# EAGLE schematic MainBoard (EAGLE 8.6.0)

## Sheet 1 of 4
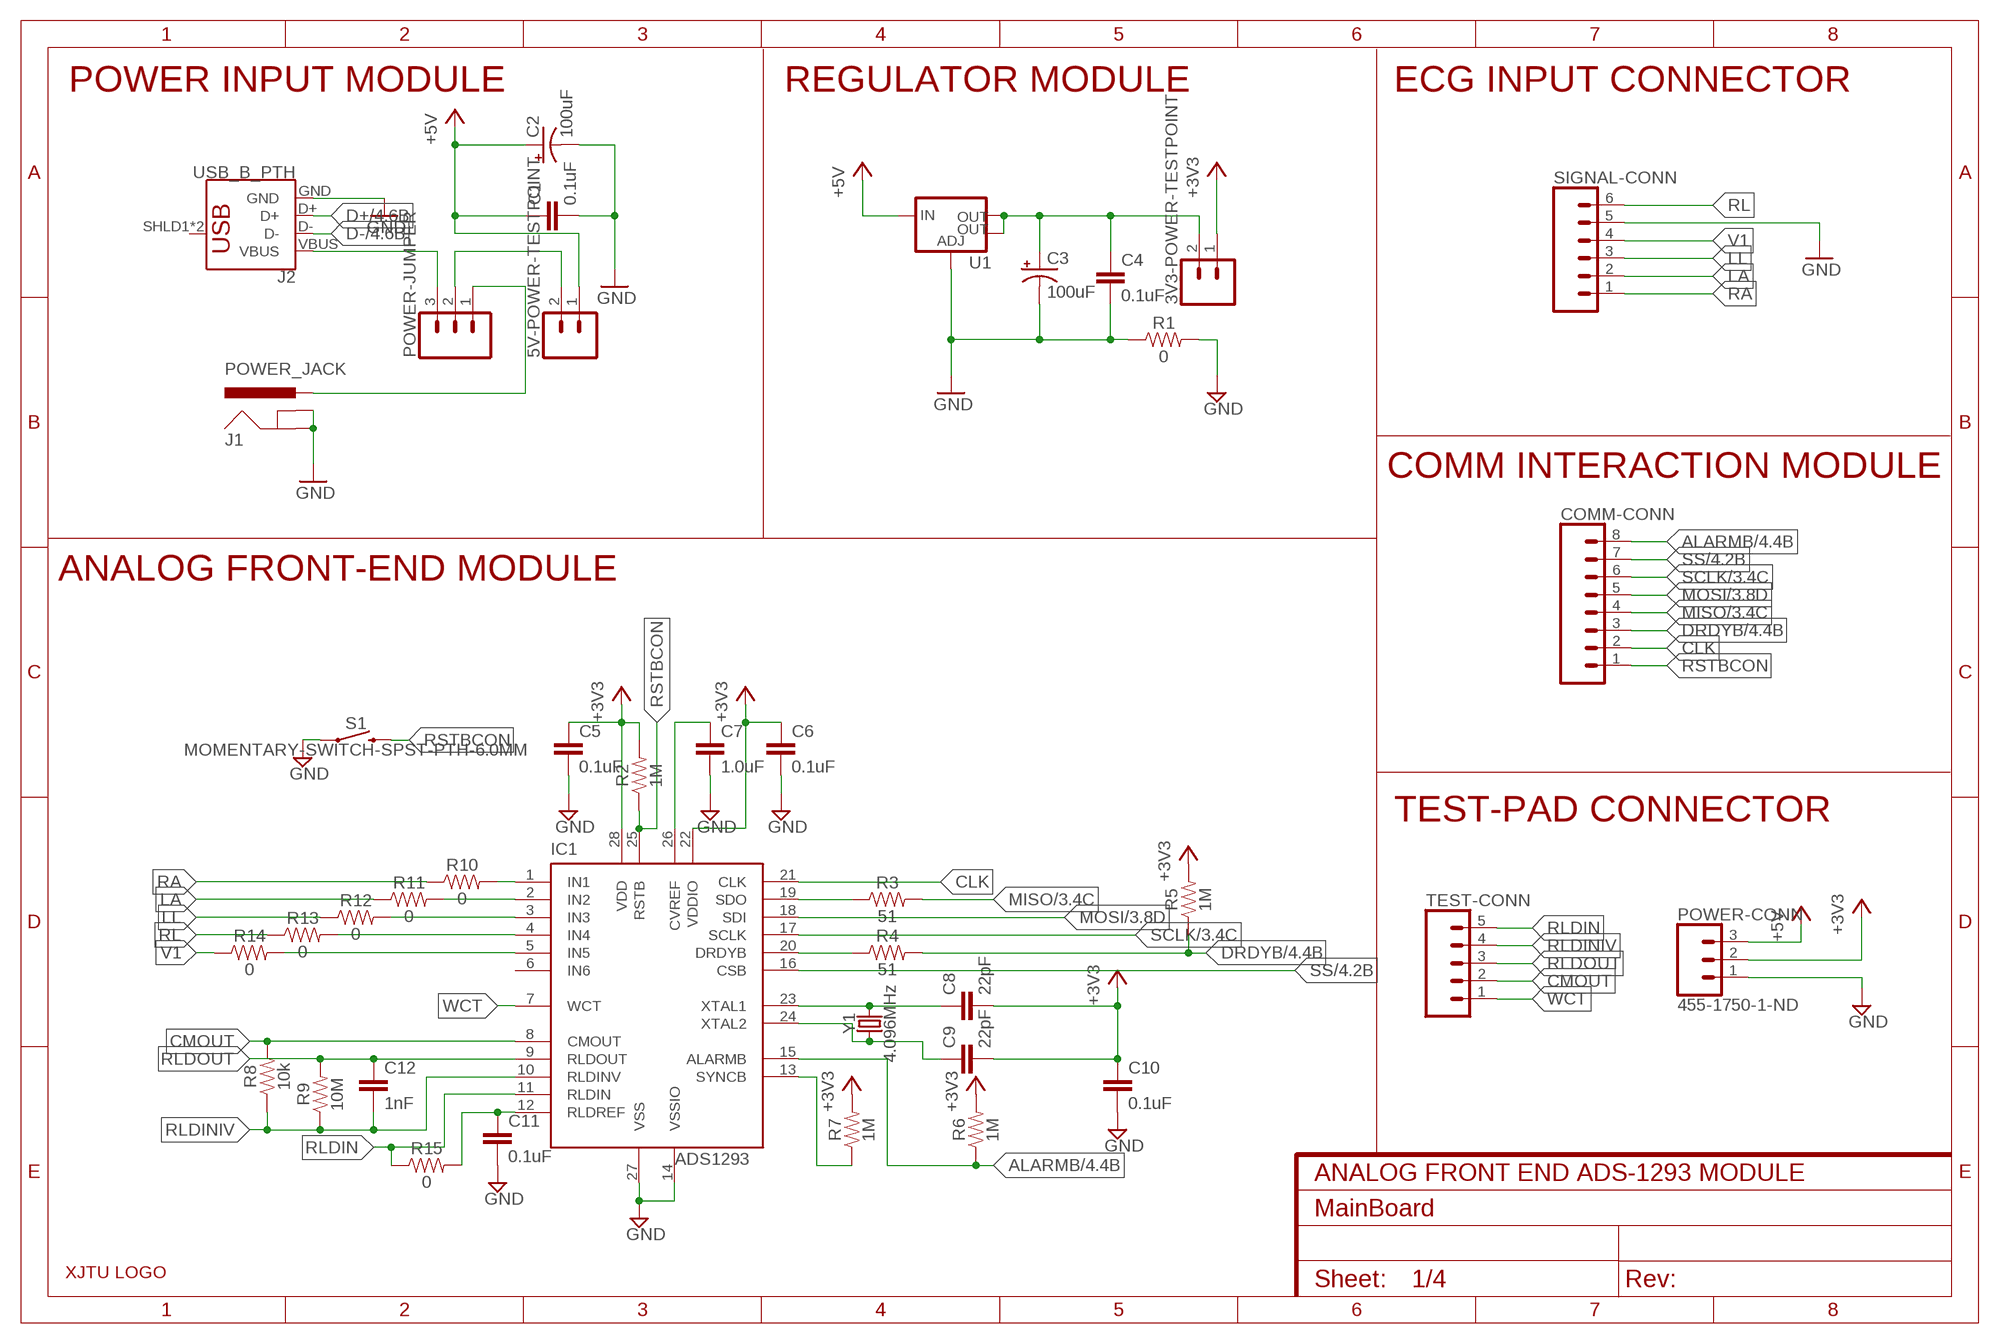
[diagram p0: schematic, sheet 1]
ADS1293TESTBOARD (FRAME-A4L): CNAME: ANALOG FRONT END ADS-1293 MODULE; CREVISION: JINMING LI; DESIGNER: JINGJIE LI

### Parts
3V3-POWER-TESTPOINT  CONN_02  [1X02]
5V-POWER-TESTPOINT  CONN_02  [1X02]
C1  0.1uF  0.1UF-0603-25V-(+80/-20%)  [0603]
C2  100uF  100UF-POLAR-RADIAL-2.5MM-25V-20%  [CPOL-RADIAL-2.5MM-6.5MM]
C3  100uF  100UF-POLAR-RADIAL-2.5MM-25V-20%  [CPOL-RADIAL-2.5MM-6.5MM]
C4  0.1uF  0.1UF-0603-25V-(+80/-20%)  [0603]
C5  0.1uF  0.1UF-0603-25V-(+80/-20%)  [0603]
C6  0.1uF  0.1UF-0603-25V-(+80/-20%)  [0603]
C7  1.0uF  1.0UF-0805-25V-10%  [0805]
C8  22pF  22PF-0603-50V-5%  [0603]
C9  22pF  22PF-0603-50V-5%  [0603]
C10  0.1uF  0.1UF-0603-25V-(+80/-20%)  [0603]
C11  0.1uF  0.1UF-0603-25V-(+80/-20%)  [0603]
C12  1nF  1.0NF/1000PF-0603-50V-10%  [0603]
COMM-CONN  CONN_08"  [1X08]
IC1  ADS1293  [QFN28-5X5]
J1  POWER_JACK  [POWER_JACK_PTH]
J2  USB_B_PTH  [USB-B-PTH]
POWER-CONN  455-1750-1-ND  CONN_03  [1X03]
POWER-JUMPER  CONN_03  [1X03]
R1  0  0OHM-0603-1/10W-5%  [0603]
R2  1M  1MOHM-0603-1/4W-5%  [0603]
R3  51  22OHM-0603-1/10W-1%  [0603]
R4  51  22OHM-0603-1/10W-1%  [0603]
R5  1M  1MOHM-0603-1/4W-5%  [0603]
R6  1M  1MOHM-0603-1/4W-5%  [0603]
R7  1M  1MOHM-0603-1/4W-5%  [0603]
R8  10k  10KOHM-0603-1/10W-1%  [0603]
R9  10M  10MOHM-0603-1/10W-5%  [0603]
R10  0  0OHM-0603-1/10W-5%  [0603]
R11  0  0OHM-0603-1/10W-5%  [0603]
R12  0  0OHM-0603-1/10W-5%  [0603]
R13  0  0OHM-0603-1/10W-5%  [0603]
R14  0  0OHM-0603-1/10W-5%  [0603]
R15  0  0OHM-0603-1/10W-5%  [0603]
S1  MOMENTARY-SWITCH-SPST-PTH-6.0MM  [TACTILE_SWITCH_PTH_6.0MM]
SIGNAL-CONN  CONN_06POLAR  [MOLEX-1X6]
TEST-CONN  CONN_05  [1X05]
U1  V_REG_LM1117SOT223  [SOT223]
U$6  XJTULOGO  [XJTULOGO]
Y1  4.096MHz  CRYSTALPTH-HC49US  [HC49US]

### Nets
+3V3: 3V3-POWER-TESTPOINT.1 C5.1 C6.1 C8.2 C9.2 C10.1 IC1.22(VDDIO) IC1.28(VDD) POWER-CONN.2 R2.2 R5.2 R6.2 R7.2 ; also sheet 4
+5V: 5V-POWER-TESTPOINT.1 C1.1 C2.1(+) POWER-CONN.3 U1.3(IN) ; also sheet 2,4
ALARMB: COMM-CONN.8 IC1.15(ALARMB) R6.1 ; also sheet 4
CLK: COMM-CONN.2 IC1.21(CLK)
CMOUT: IC1.8(CMOUT) R8.2 TEST-CONN.2
D+: J2.D+ ; also sheet 4
D-: J2.D- ; also sheet 4
DRDYB: COMM-CONN.3 R4.2 R5.1 ; also sheet 4
GND: C1.2 C2.2(-) C3.2(-) C4.2 C5.2 C6.2 C7.2 C10.2 C11.2 IC1.14(VSSIO) IC1.27(VSS) J1.GND J1.GNDBREAK J2.GND POWER-CONN.1 R1.1 R1.2 S1.1 SIGNAL-CONN.5 U1.1(ADJ) ; also sheet 2,3,4
LA: R11.1 SIGNAL-CONN.2
LL: R12.1 SIGNAL-CONN.3
MISO: COMM-CONN.4 R3.2 ; also sheet 3,4
MOSI: COMM-CONN.5 IC1.18(SDI) ; also sheet 3,4
N$1: C7.1 IC1.26(CVREF)
N$2: J2.VBUS POWER-JUMPER.3
N$3: J1.PWR POWER-JUMPER.1
N$5: C8.1 IC1.23(XTAL1) Y1.2
N$6: C9.1 IC1.24(XTAL2) Y1.1
N$7: IC1.19(SDO) R3.1
N$8: IC1.20(DRDYB) R4.1
N$9: IC1.13(SYNCB) R7.1
N$10: C11.1 IC1.12(RLDREF) R15.2
N$11: IC1.1(IN1) R10.2
N$12: IC1.2(IN2) R11.2
N$13: IC1.3(IN3) R12.2
N$14: IC1.4(IN4) R13.2
N$15: IC1.5(IN5) R14.2
N$16: 5V-POWER-TESTPOINT.2 POWER-JUMPER.2
N$17: 3V3-POWER-TESTPOINT.2 C3.1(+) C4.1 U1.2(OUT) U1.4(OUT)
RA: R10.1 SIGNAL-CONN.1
RL: R13.1 SIGNAL-CONN.6
RLDIN: IC1.11(RLDIN) R15.1 TEST-CONN.5
RLDINIV: C12.2 IC1.10(RLDINV) R8.1 R9.1 TEST-CONN.4
RLDOUT: C12.1 IC1.9(RLDOUT) R9.2 TEST-CONN.3
RSTBCON: COMM-CONN.1 IC1.25(RSTB) R2.1 S1.3
SCLK: COMM-CONN.6 IC1.17(SCLK) ; also sheet 3,4
SS: COMM-CONN.7 IC1.16(CSB) ; also sheet 4
V1: R14.1 SIGNAL-CONN.4
WCT: IC1.7(WCT) TEST-CONN.1
Unconnected: IC1.6(IN6) J2.SHLD1(SHIELD) J2.SHLD2(SHIELD)

### Notes on the sheet
- POWER INPUT MODULE | REGULATOR MODULE | ECG INPUT CONNECTOR
- COMM INTERACTION MODULE
- ANALOG FRONT-END MODULE
- TEST-PAD CONNECTOR

## Sheet 2 of 4
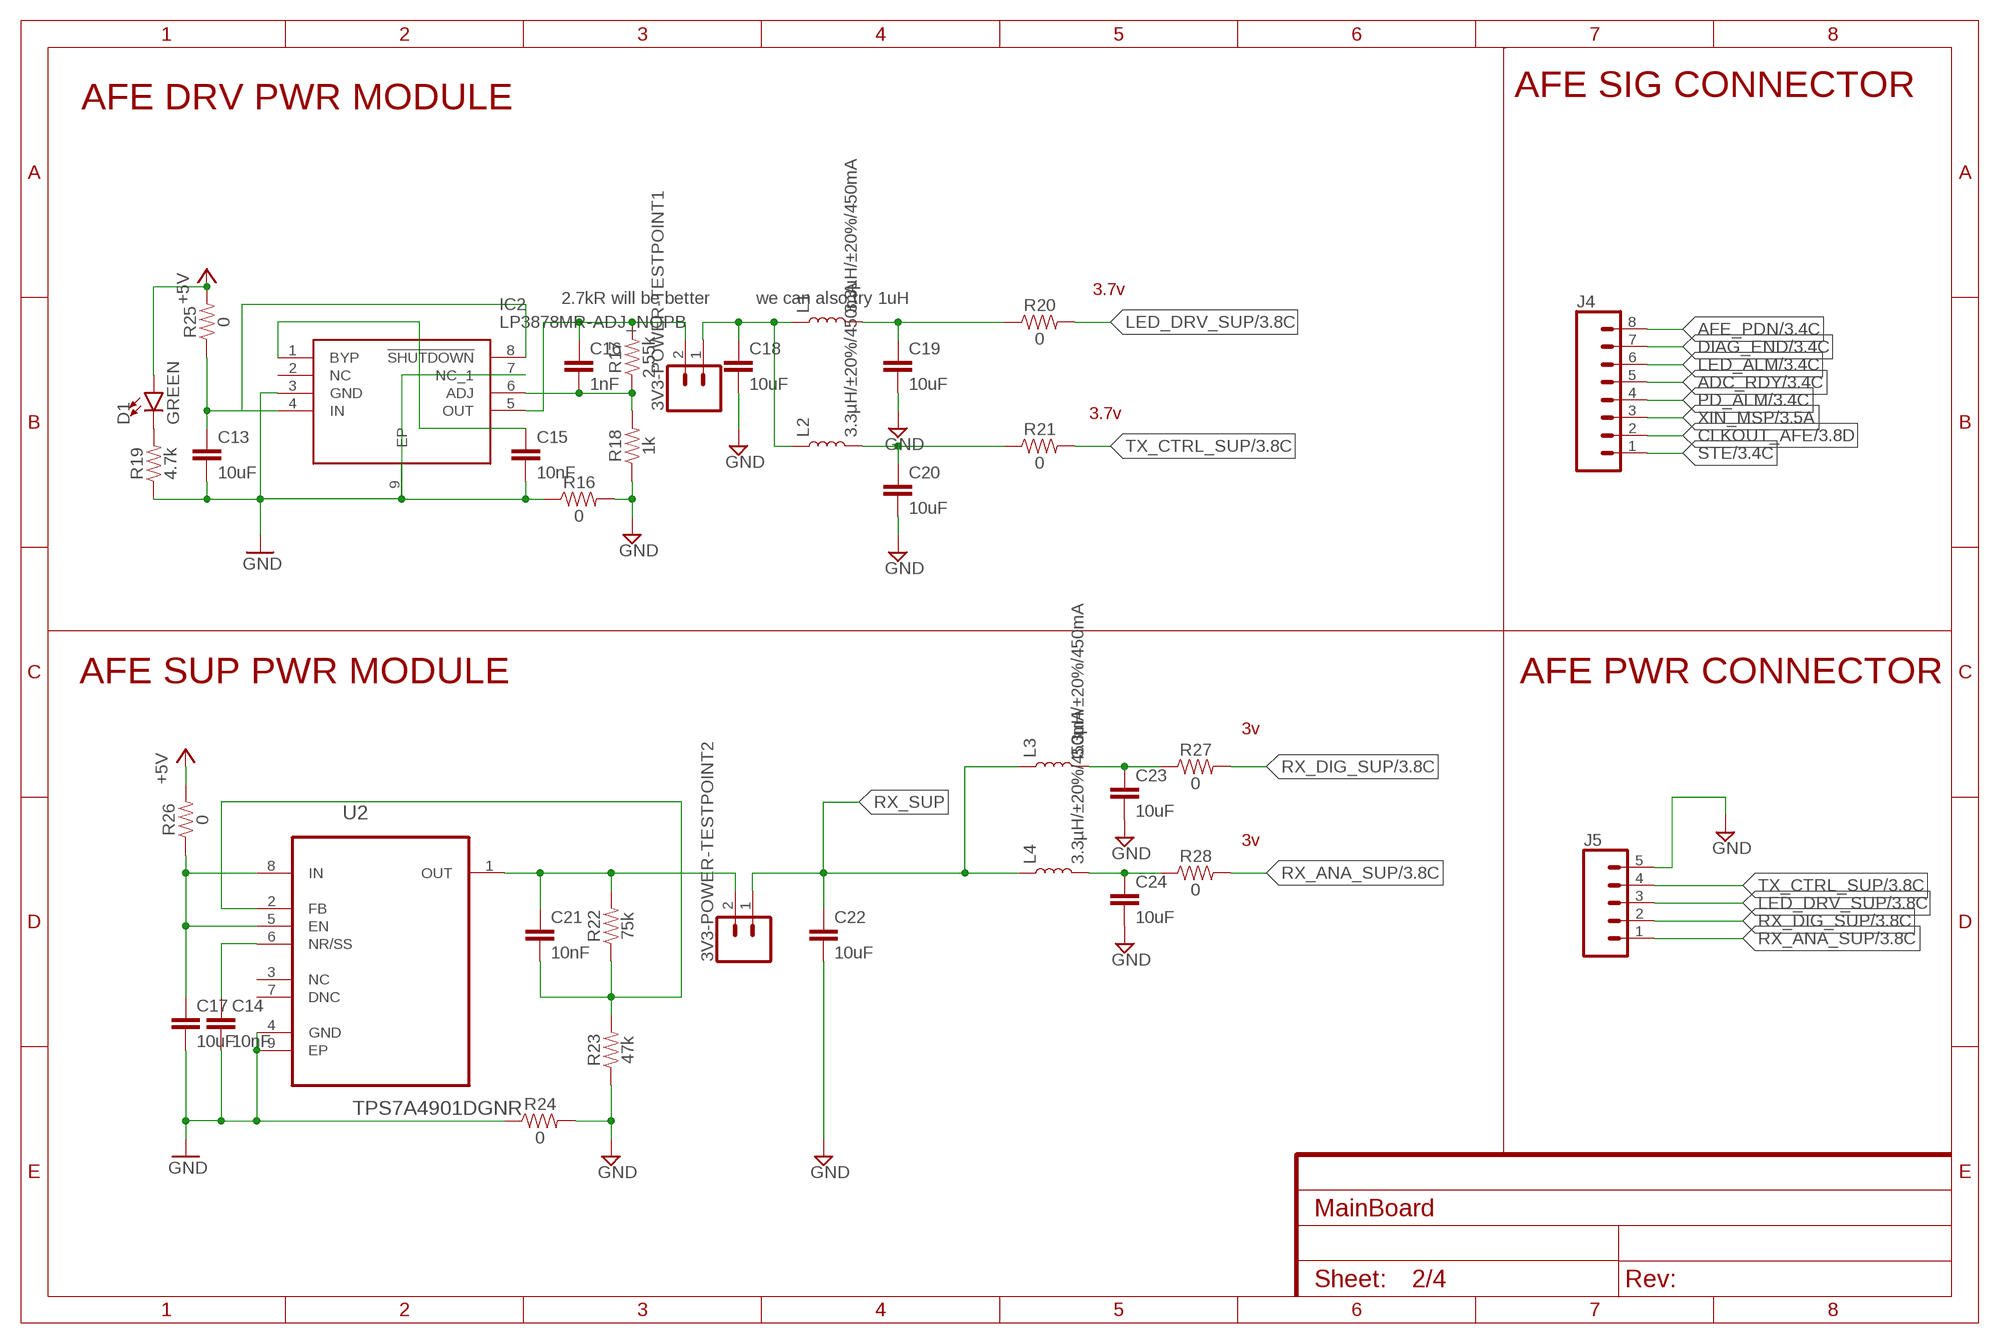
[diagram p1: schematic, sheet 2]
FRAME2 (FRAME-A4L): CNAME: AFE4400 LDO Module; CREVISION: JINMING LI; DESIGNER: JINGJIE LI

### Parts
3V3-POWER-TESTPOINT1  CONN_02  [1X02]
3V3-POWER-TESTPOINT2  CONN_02  [1X02]
C13  10uF  10UF-1206-6.3V-20%  [1206]
C14  10nF  10NF-0603-50V-10%  [0603]
C15  10nF  10NF-0603-50V-10%  [0603]
C16  1nF  1.0NF/1000PF-0603-50V-10%  [0603]
C17  10uF  10UF-1206-6.3V-20%  [1206]
C18  10uF  10UF-1206-6.3V-20%  [1206]
C19  10uF  10UF-1206-6.3V-20%  [1206]
C20  10uF  10UF-1206-6.3V-20%  [1206]
C21  10nF  10NF-0603-50V-10%  [0603]
C22  10uF  10UF-1206-6.3V-20%  [1206]
C23  10uF  10UF-1206-6.3V-20%  [1206]
C24  10uF  10UF-1206-6.3V-20%  [1206]
D1  GREEN  LED-GREEN1206  [LED-1206]
IC2  LP3878MR-ADJ_NOPB  [SOIC127P602X168-9N]
J4  CONN_08"  [1X08]
J5  CONN_05  [1X05]
L1  3.3µH/±20%/450mA  INDUCTOR-0805-3.3UH  [0805]
L2  3.3µH/±20%/450mA  INDUCTOR-0805-3.3UH  [0805]
L3  3.3µH/±20%/450mA  INDUCTOR-0805-3.3UH  [0805]
L4  3.3µH/±20%/450mA  INDUCTOR-0805-3.3UH  [0805]
R16  0  0OHM-0603-1/10W-5%  [0603]
R17  2.55k  2.55KOHM-0603-1/10W-1%  [0603]
R18  1k  1KOHM-0603-1/10W-1%  [0603]
R19  4.7k  4.7KOHM-0603-1/10W-1%  [0603]
R20  0  0OHM-0603-1/10W-5%  [0603]
R21  0  0OHM-0603-1/10W-5%  [0603]
R22  75k  75KOHM-0603-1/10W-1%  [0603]
R23  47k  47KOHM-0603-1/10W-1%  [0603]
R24  0  0OHM-0603-1/10W-5%  [0603]
R25  0  0OHM-0603-1/10W-5%  [0603]
R26  0  0OHM-0603-1/10W-5%  [0603]
R27  0  0OHM-0603-1/10W-5%  [0603]
R28  0  0OHM-0603-1/10W-5%  [0603]
U2  TPS7A4901DGNR  [SOP65P490X110-9N]

### Nets
+5V: D1.A R25.2 R26.2 ; also sheet 1,4
ADC_RDY: J4.5 ; also sheet 3,4
AFE_PDN: J4.8 ; also sheet 3,4
CLKOUT_AFE: J4.2 ; also sheet 3
DIAG_END: J4.7 ; also sheet 3,4
GND: C13.2 C14.2 C15.2 C17.2 C18.2 C19.2 C20.2 C22.2 C23.2 C24.2 IC2.3(GND) IC2.7(NC_1) IC2.9(EP) J5.5 R16.1 R16.2 R18.1 R19.1 R23.1 R24.1 R24.2 U2.4(GND) U2.9(EP) ; also sheet 1,3,4
LED_ALM: J4.6 ; also sheet 3,4
LED_DRV_SUP: J5.3 R20.2 ; also sheet 3
N$4: D1.C R19.2
N$18: 3V3-POWER-TESTPOINT1.1 C18.1 L1.1 L2.1
N$19: C16.2 IC2.6(ADJ) R17.1 R18.2
N$20: C15.1 IC2.1(BYP)
N$21: 3V3-POWER-TESTPOINT1.2 C16.1 IC2.5(OUT) R17.2
N$22: C14.1 U2.6(NR/SS)
N$23: C19.1 L1.2 R20.1
N$24: C20.1 L2.2 R21.1
N$25: C17.1 R26.1 U2.5(EN) U2.8(IN)
N$26: 3V3-POWER-TESTPOINT2.2 C21.1 R22.2 U2.1(OUT)
N$27: C21.2 R22.1 R23.2 U2.2(FB)
N$28: C23.1 L3.2 R27.1
N$29: C13.1 IC2.4(IN) IC2.8(!SHUTDOWN) R25.1
N$30: C24.1 L4.2 R28.1
PD_ALM: J4.4 ; also sheet 3,4
RX_ANA_SUP: J5.1 R28.2 ; also sheet 3
RX_DIG_SUP: J5.2 R27.2 ; also sheet 3
RX_SUP: 3V3-POWER-TESTPOINT2.1 C22.1 L3.1 L4.1
STE: J4.1 ; also sheet 3,4
TX_CTRL_SUP: J5.4 R21.2 ; also sheet 3
XIN_MSP: J4.3 ; also sheet 3,4
Unconnected: IC2.2(NC) U2.3(NC) U2.7(DNC)

### Notes on the sheet
- AFE SIG CONNECTOR
- AFE DRV PWR MODULE
- 3.7v
- 2.7kR will be better | we can also try 1uH
- 3.7v
- AFE SUP PWR MODULE | AFE PWR CONNECTOR
- 3v
- 3v

## Sheet 3 of 4
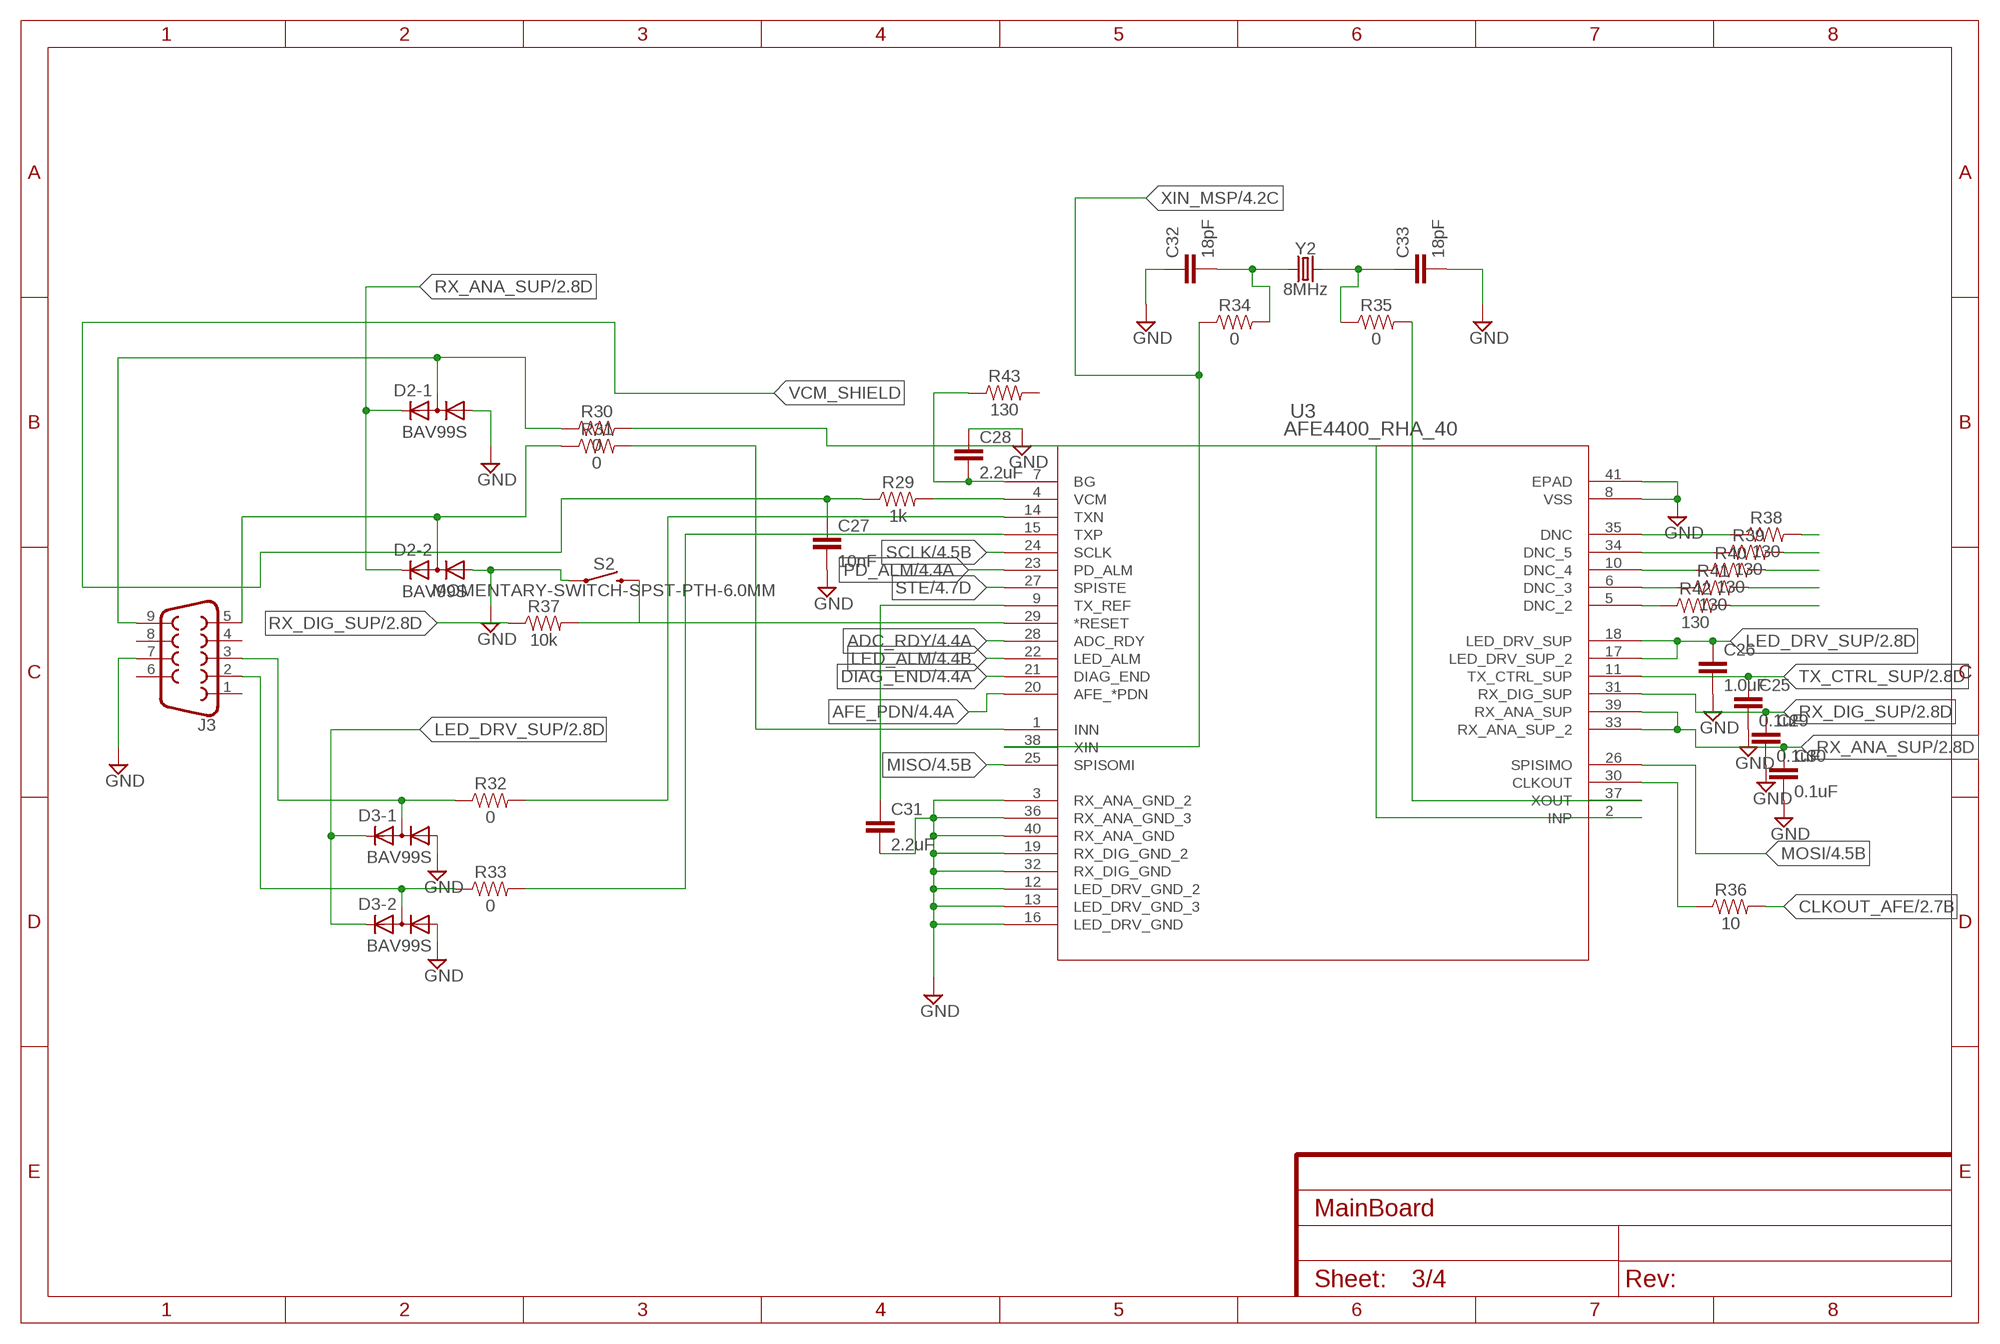
[diagram p2: schematic, sheet 3]
FRAME1 (FRAME-A4L): CNAME: AFE4400 Oximeter Module; CREVISION: JINMING LI; DESIGNER: JINGJIE LI

### Parts
C25  0.1uF  0.1UF-0603-25V-5%  [0603]
C26  1.0uF  1.0UF-0805-25V-10%  [0805]
C27  10nF  10NF-0603-50V-10%  [0603]
C28  2.2uF  2.2UF-0805-25V-(+80/-20%)  [0805]
C29  0.1uF  0.1UF-0603-25V-5%  [0603]
C30  0.1uF  0.1UF-0603-25V-5%  [0603]
C31  2.2uF  2.2UF-0805-25V-(+80/-20%)  [0805]
C32  18pF  18PF-0603-50V-5%  [0603]
C33  18pF  18PF-0603-50V-5%  [0603]
D2  BAV99S  [SOT363]
D3  BAV99S  [SOT363]
J3  DB9FEMALE  [DB9]
R29  1k  1KOHM-0603-1/10W-1%  [0603]
R30  0  0OHM-0603-1/10W-5%  [0603]
R31  0  0OHM-0603-1/10W-5%  [0603]
R32  0  0OHM-0603-1/10W-5%  [0603]
R33  0  0OHM-0603-1/10W-5%  [0603]
R34  0  0OHM-0603-1/10W-5%  [0603]
R35  0  0OHM-0603-1/10W-5%  [0603]
R36  10  10OHM-0603-1/10W-1%  [0603]
R37  10k  10KOHM-0603-1/10W-1%  [0603]
R38  130  330OHM-0603-1/10W-1%  [0603]
R39  130  330OHM-0603-1/10W-1%  [0603]
R40  130  330OHM-0603-1/10W-1%  [0603]
R41  130  330OHM-0603-1/10W-1%  [0603]
R42  130  330OHM-0603-1/10W-1%  [0603]
R43  130  330OHM-0603-1/10W-1%  [0603]
S2  MOMENTARY-SWITCH-SPST-PTH-6.0MM  [TACTILE_SWITCH_PTH_6.0MM]
U3  AFE4400_RHA_40  [RHA40_4P15X4P15]
Y2  8MHz  CRYSTAL-8MHZSMD-5X3.2  [CRYSTAL-SMD-5X3.2-4PAD]

### Nets
ADC_RDY: U3.28(ADC_RDY) ; also sheet 2,4
AFE_PDN: U3.20(AFE_*PDN) ; also sheet 2,4
CLKOUT_AFE: R36.2 ; also sheet 2
DIAG_END: U3.21(DIAG_END) ; also sheet 2,4
GND: C25.2 C26.2 C27.2 C28.1 C29.2 C30.2 C31.2 C32.1 C33.2 D2.1(-1:A1) D2.4(-2:A1) D3.1(-1:A1) D3.4(-2:A1) J3.7 S2.1 U3.3(RX_ANA_GND_2) U3.8(VSS) U3.12(LED_DRV_GND_2) U3.13(LED_DRV_GND_3) U3.16(LED_DRV_GND) U3.19(RX_DIG_GND_2) U3.32(RX_DIG_GND) U3.36(RX_ANA_GND_3) U3.40(RX_ANA_GND) U3.41(EPAD) ; also sheet 1,2,4
LED_ALM: U3.22(LED_ALM) ; also sheet 2,4
LED_DRV_SUP: C26.1 D3.2(-1:K2) D3.5(-2:K2) U3.17(LED_DRV_SUP_2) U3.18(LED_DRV_SUP) ; also sheet 2
MISO: U3.25(SPISOMI) ; also sheet 1,4
MOSI: U3.26(SPISIMO) ; also sheet 1,4
N$31: C28.2 R43.1 U3.7(BG)
N$32: C31.1 U3.9(TX_REF)
N$33: R32.2 U3.14(TXN)
N$34: R29.2 U3.4(VCM)
N$36: R31.2 U3.1(INN)
N$37: R30.2 U3.2(INP)
N$38: D2.3(-2:K1A2) J3.5 R31.1
N$39: D2.6(-1:K1A2) J3.9 R30.1
N$40: R33.2 U3.15(TXP)
N$41: D3.6(-1:K1A2) J3.3 R32.1
N$42: D3.3(-2:K1A2) J3.2 R33.1
N$43: C32.2 R34.2 Y2.1
N$44: C33.1 R35.1 Y2.3
N$45: R36.1 U3.30(CLKOUT)
N$46: R37.2 S2.3 U3.29(*RESET)
N$48: R35.2 U3.37(XOUT)
N$49: R38.1 U3.35(DNC)
N$50: R42.1 U3.5(DNC_2)
N$52: R41.1 U3.6(DNC_3)
N$53: R40.1 U3.10(DNC_4)
N$54: R39.1 U3.34(DNC_5)
N$55: R38.2
N$56: R39.2
N$57: R40.2
N$58: R41.2
N$59: R42.2
PD_ALM: U3.23(PD_ALM) ; also sheet 2,4
RX_ANA_SUP: C30.1 D2.2(-1:K2) D2.5(-2:K2) U3.33(RX_ANA_SUP_2) U3.39(RX_ANA_SUP) ; also sheet 2
RX_DIG_SUP: C29.1 R37.1 U3.31(RX_DIG_SUP) ; also sheet 2
SCLK: U3.24(SCLK) ; also sheet 1,4
STE: U3.27(SPISTE) ; also sheet 2,4
TX_CTRL_SUP: C25.1 U3.11(TX_CTRL_SUP) ; also sheet 2
VCM_SHIELD: C27.1 R29.1
XIN_MSP: R34.1 U3.38(XIN) ; also sheet 2,4
Unconnected: J3.1 J3.4 J3.6 J3.8 R43.2

## Sheet 4 of 4
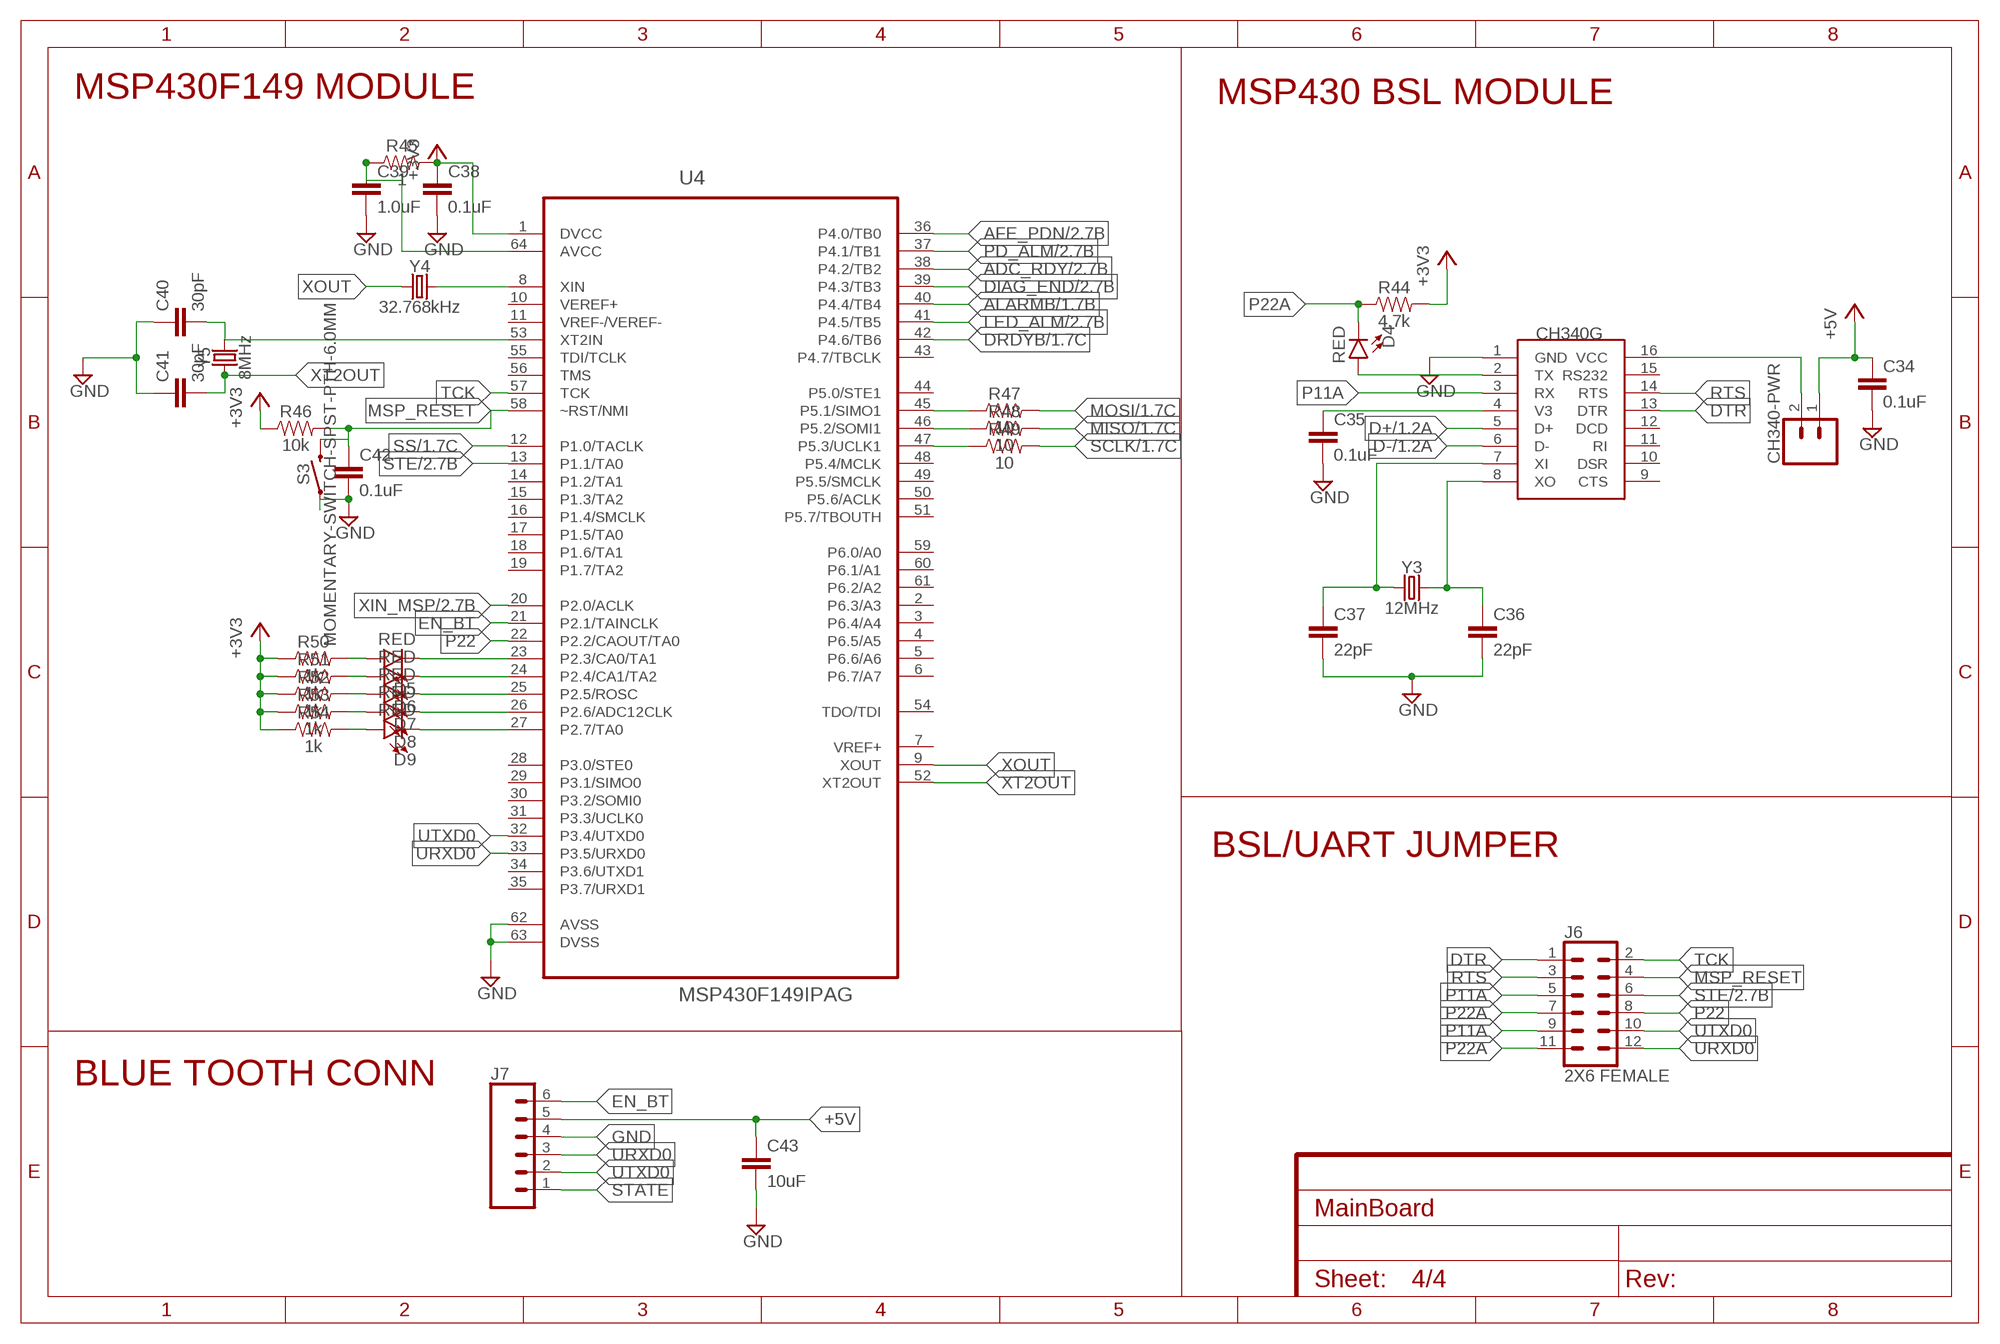
[diagram p3: schematic, sheet 4]
FRAME3 (FRAME-A4L): CNAME: MSP430 MCU Module; CREVISION: JINMING LI; DESIGNER: JINGJIE LI

### Parts
C34  0.1uF  0.1UF-0603-25V-(+80/-20%)  [0603]
C35  0.1uF  0.1UF-0603-25V-(+80/-20%)  [0603]
C36  22pF  22PF-0603-50V-5%  [0603]
C37  22pF  22PF-0603-50V-5%  [0603]
C38  0.1uF  0.1UF-0603-25V-5%  [0603]
C39  1.0uF  1.0UF-0603-16V-10%  [0603]
C40  30pF  33PF-0603-50V-5%  [0603]
C41  30pF  33PF-0603-50V-5%  [0603]
C42  0.1uF  0.1UF-0603-25V-5%  [0603]
C43  10uF  10UF-1206-6.3V-20%  [1206]
CH340-PWR  CONN_02  [1X02]
D4  RED  LED-RED0603  [LED-0603]
D5  RED  LED-RED0603  [LED-0603]
D6  RED  LED-RED0603  [LED-0603]
D7  RED  LED-RED0603  [LED-0603]
D8  RED  LED-RED0603  [LED-0603]
D9  RED  LED-RED0603  [LED-0603]
J6  2X6 FEMALE  CONN_06X2PTH_FEMALE  [2X6]
J7  CONN_06SILK_FEMALE_PTH  [1X06]
R44  4.7k  4.7KOHM-0603-1/10W-1%  [0603]
R45  1  1OHM-0603-1/10W-1%  [0603]
R46  10k  10KOHM-0603-1/10W-1%  [0603]
R47  10  10OHM-0603-1/10W-1%  [0603]
R48  10  10OHM-0603-1/10W-1%  [0603]
R49  10  10OHM-0603-1/10W-1%  [0603]
R50  1k  1KOHM-0603-1/10W-1%  [0603]
R51  1k  1KOHM-0603-1/10W-1%  [0603]
R52  1k  1KOHM-0603-1/10W-1%  [0603]
R53  1k  1KOHM-0603-1/10W-1%  [0603]
R54  1k  1KOHM-0603-1/10W-1%  [0603]
S3  MOMENTARY-SWITCH-SPST-PTH-6.0MM  [TACTILE_SWITCH_PTH_6.0MM]
U4  MSP430F149IPAG  [QFP50P1200X1200X120-64N]
U$5  CH340G  [SOIC16]
Y3  12MHz  CRYSTAL-12MHZ"  [CRYSTAL-SMD-5X3.2-4PAD]
Y4  32.768kHz  CRYSTAL-32.768KHZSMD-3.2X1.5  [CRYSTAL-SMD-3.2X1.5MM]
Y5  8MHz  CRYSTAL-8MHZSMD-5X3.2  [CRYSTAL-SMD-5X3.2-4PAD]

### Nets
+3V3: C38.1 R44.2 R45.2 R46.1 R50.1 R51.1 R52.1 R53.1 R54.1 U4.1(DVCC) ; also sheet 1
+5V: C34.1 C43.1 CH340-PWR.1 J7.5 ; also sheet 1,2
ADC_RDY: U4.38(P4.2/TB2) ; also sheet 2,3
AFE_PDN: U4.36(P4.0/TB0) ; also sheet 2,3
ALARMB: U4.40(P4.4/TB4) ; also sheet 1
D+: U$5.5(D+) ; also sheet 1
D-: U$5.6(D-) ; also sheet 1
DIAG_END: U4.39(P4.3/TB3) ; also sheet 2,3
DRDYB: U4.42(P4.6/TB6) ; also sheet 1
DTR: J6.1 U$5.13(DTR)
EN_BT: J7.6 U4.21(P2.1/TAINCLK)
GND: C34.2 C35.2 C36.2 C37.2 C38.2 C39.2 C40.1 C41.1 C42.2 C43.2 J7.4 S3.1 U4.62(AVSS) U4.63(DVSS) U$5.1(GND) ; also sheet 1,2,3
LED_ALM: U4.41(P4.5/TB5) ; also sheet 2,3
MISO: R48.2 ; also sheet 1,3
MOSI: R47.2 ; also sheet 1,3
MSP_RESET: C42.1 J6.4 R46.2 S3.3 U4.58(~RST/NMI)
N$65: C39.1 R45.1 U4.64(AVCC)
N$66: R47.1 U4.45(P5.1/SIMO1)
N$67: C35.1 U$5.4(V3)
N$68: D4.A U$5.2(TX)
N$69: U4.8(XIN) Y4.P$2
N$70: C40.2 U4.53(XT2IN) Y5.3
N$71: R48.1 U4.46(P5.2/SOMI1)
N$72: R49.1 U4.47(P5.3/UCLK1)
N$73: D5.C U4.23(P2.3/CA0/TA1)
N$74: D6.C U4.24(P2.4/CA1/TA2)
N$75: D7.C U4.25(P2.5/ROSC)
N$76: D8.C U4.26(P2.6/ADC12CLK)
N$77: D9.C U4.27(P2.7/TA0)
N$78: D5.A R50.2
N$79: D6.A R51.2
N$80: D7.A R52.2
N$81: D8.A R53.2
N$82: D9.A R54.2
N$84: CH340-PWR.2 U$5.16(VCC)
P11A: J6.5 J6.9 U$5.3(RX)
P22: J6.8 U4.22(P2.2/CAOUT/TA0)
P22A: D4.C J6.7 J6.11 R44.1
PD_ALM: U4.37(P4.1/TB1) ; also sheet 2,3
RTS: J6.3 U$5.14(RTS)
SCLK: R49.2 ; also sheet 1,3
SS: U4.12(P1.0/TACLK) ; also sheet 1
STATE: J7.1
STE: J6.6 U4.13(P1.1/TA0) ; also sheet 2,3
TCK: J6.2 U4.57(TCK)
URXD0: J6.12 J7.3 U4.33(P3.5/URXD0)
UTXD0: J6.10 J7.2 U4.32(P3.4/UTXD0)
XI: C37.1 U$5.7(XI) Y3.1
XIN_MSP: U4.20(P2.0/ACLK) ; also sheet 2,3
XO: C36.1 U$5.8(XO) Y3.3
XOUT: U4.9(XOUT) Y4.P$1
XT2OUT: C41.2 U4.52(XT2OUT) Y5.1
Unconnected: U4.2(P6.3/A3) U4.3(P6.4/A4) U4.4(P6.5/A5) U4.5(P6.6/A6) U4.6(P6.7/A7) U4.7(VREF+) U4.10(VEREF+) U4.11(VREF-/VEREF-) U4.14(P1.2/TA1) U4.15(P1.3/TA2) U4.16(P1.4/SMCLK) U4.17(P1.5/TA0) U4.18(P1.6/TA1) U4.19(P1.7/TA2) U4.28(P3.0/STE0) U4.29(P3.1/SIMO0) U4.30(P3.2/SOMI0) U4.31(P3.3/UCLK0) U4.34(P3.6/UTXD1) U4.35(P3.7/URXD1) U4.43(P4.7/TBCLK) U4.44(P5.0/STE1) U4.48(P5.4/MCLK) U4.49(P5.5/SMCLK) U4.50(P5.6/ACLK) U4.51(P5.7/TBOUTH) U4.54(TDO/TDI) U4.55(TDI/TCLK) U4.56(TMS) U4.59(P6.0/A0) U4.60(P6.1/A1) U4.61(P6.2/A2) U$5.9(CTS) U$5.10(DSR) U$5.11(RI) U$5.12(DCD) U$5.15(RS232)

### Notes on the sheet
- MSP430F149 MODULE | MSP430 BSL MODULE
- BSL/UART JUMPER
- BLUE TOOTH CONN

## Library data of the parts
3V3-POWER-TESTPOINT 3V3-POWER-TESTPOINT1 3V3-POWER-TESTPOINT2 5V-POWER-TESTPOINT CH340-PWR = SparkFun-Connectors:CONN_02: Multi connection point. Often used as Generic Header-pin footprint for 0.1 inch spaced/style header connections On any of the 0.1 inch spaced packages, you can populate with these: Break Away Headers - Straight <https://www.sparkfun.com/products/116> (PRT-00116) Break Away Male Headers - Right Angle <https://www.sparkfun.com/products/553> (PRT-00553) Female Headers <https://www.sparkfun.com/products/115> (PRT-00115) Break Away Headers - Machine Pin <https://www.sparkfun.com/products/117> (PRT-00117) Break Away Female Headers - Swiss Machine Pin <https://www.sparkfun.com/products/743> (PRT-00743) For SCREWTERMINALS and SPRING TERMINALS visit here: Screw Terimnals on SparkFun.com <https://www.sparkfun.com/search/results?term=Screw+Terminals> (5mm/3.5mm/2.54mm spacing) This device is also useful as a general connection point to wire up your design to another part of your project. Our various solder wires solder well into these plated through hole pads. Hook-Up Wire - Assortment (Stranded, 22 AWG) <https://www.sparkfun.com/products/11375> (PRT-11375) Hook-Up Wire - Assortment (Solid Core, 22 AWG) <https://www.sparkfun.com/products/11367> (PRT-11367) View the entire wire category on our website here <https://www.sparkfun.com/categories/141> Special notes: Molex polarized connector foot print use with: PRT-08233 with associated crimp pins and housings. 2.54_SCREWTERM for use with PRT-10571. 3.5mm Screw Terminal footprints for PRT-08084 5mm Screw Terminal footprints for use with PRT-08432
C1 C4-C6 C10 C11 C34 C35 = SparkFun-Capacitors:0.1UF: 0.1µF ceramic capacitors A capacitor is a passive two-terminal electrical component used to store electrical energy temporarily in an electric field.; PROD_ID: CAP-00810
C2 C3 = SparkFun-Capacitors:100UF-POLAR: 100µF polarized capacitors A capacitor is a passive two-terminal electrical component used to store electrical energy temporarily in an electric field.; PROD_ID: CAP-08439
C7 C26 = SparkFun-Capacitors:1.0UF: 1µF ceramic capacitors A capacitor is a passive two-terminal electrical component used to store electrical energy temporarily in an electric field.; PROD_ID: CAP-08064
C8 C9 C36 C37 = SparkFun-Capacitors:22PF: 22pF ceramic capacitors A capacitor is a passive two-terminal electrical component used to store electrical energy temporarily in an electric field.; PROD_ID: CAP-07876
C12 C16 = SparkFun-Capacitors:1.0NF/1000PF: 1nF/1,000pF ceramic capacitors A capacitor is a passive two-terminal electrical component used to store electrical energy temporarily in an electric field.; PROD_ID: CAP-07886
C13 C17-C20 C22-C24 C43 = SparkFun-Capacitors:10UF: 10.0µF ceramic capacitors A capacitor is a passive two-terminal electrical component used to store electrical energy temporarily in an electric field.; PROD_ID: CAP-10057
C14 C15 C21 C27 = SparkFun-Capacitors:10NF: 0.01uF/10nF/10,000pF ceramic capacitors A capacitor is a passive two-terminal electrical component used to store electrical energy temporarily in an electric field. CAP-09321; PROD_ID: CAP-00867
C25 C29 C30 C38 C42 = SparkFun-Capacitors:0.1UF: 0.1µF ceramic capacitors A capacitor is a passive two-terminal electrical component used to store electrical energy temporarily in an electric field.; PROD_ID: CAP-08604
C28 C31 = SparkFun-Capacitors:2.2UF: 2.2µF ceramic capacitors A capacitor is a passive two-terminal electrical component used to store electrical energy temporarily in an electric field.; PROD_ID: CAP-11624
C32 C33 = SparkFun-Capacitors:18PF: 18pF ceramic capacitors A capacitor is a passive two-terminal electrical component used to store electrical energy temporarily in an electric field.; PROD_ID: CAP-08267
C39 = SparkFun-Capacitors:1.0UF: 1µF ceramic capacitors A capacitor is a passive two-terminal electrical component used to store electrical energy temporarily in an electric field.; PROD_ID: CAP-00868
C40 C41 = SparkFun-Capacitors:33PF: 33pF ceramic capacitors A capacitor is a passive two-terminal electrical component used to store electrical energy temporarily in an electric field.; PROD_ID: CAP-10142; VALUE: 33pF
COMM-CONN J4 = SparkFun-Connectors:CONN_08: Multi connection point. Often used as Generic Header-pin footprint for 0.1 inch spaced/style header connections On any of the 0.1 inch spaced packages, you can populate with these: Break Away Headers - Straight <https://www.sparkfun.com/products/116> (PRT-00116) Break Away Male Headers - Right Angle <https://www.sparkfun.com/products/553> (PRT-00553) Female Headers <https://www.sparkfun.com/products/115> (PRT-00115) Break Away Headers - Machine Pin <https://www.sparkfun.com/products/117> (PRT-00117) Break Away Female Headers - Swiss Machine Pin <https://www.sparkfun.com/products/743> (PRT-00743) Arduino Stackable Header - 8 Pin <https://www.sparkfun.com/products/9279> (PRT-09279) For SCREWTERMINALS and SPRING TERMINALS visit here: Screw Terimnals on SparkFun.com <https://www.sparkfun.com/search/results?term=Screw+Terminals> (5mm/3.5mm/2.54mm spacing) This device is also useful as a general connection point to wire up your design to another part of your project. Our various solder wires solder well into these plated through hole pads. Hook-Up Wire - Assortment (Stranded, 22 AWG) <https://www.sparkfun.com/products/11375> (PRT-11375) Hook-Up Wire - Assortment (Solid Core, 22 AWG) <https://www.sparkfun.com/products/11367> (PRT-11367) View the entire wire category on our website here <https://www.sparkfun.com/categories/141> Special notes: Molex polarized connector foot print use with SKU : PRT-08231 with associated crimp pins and housings. 1MM SMD Version SKU: PRT-10208 NOTES ON THE VARIANTS LOCK and LOCK_LONGPADS... This footprint was designed to help hold the alignment of a through-hole component (i.e. 6-pin header) while soldering it into place. You may notice that each hole has been shifted either up or down by 0.005 of an inch from it's more standard position (which is a perfectly straight line). This slight alteration caused the pins (the squares in the middle) to touch the edges of the holes. Because they are alternating, it causes a "brace" to hold the component in place. 0.005 has proven to be the perfect amount of "off-center" position when using our standard breakaway headers. Although looks a little odd when you look at the bare footprint, once you have a header in there, the alteration is very hard to notice. Also,if you push a header all the way into place, it is covered up entirely on the bottom side.; PROD_ID: CONN-08438
D1 = SparkFun-LED:LED-GREEN: Green SMD LED Used in manufacturing of various products at SparkFun Packages: 0603 - SMD 0603 package [Product Link] <http://www.futureelectronics.com/en/technologies/semiconductors/optoelectronics/leds/Pages/9894312-LTST-C190GKT.aspx?CrossPart=HSMG-C190&IM=0> LilyPad 1206 - SMD1206 LilyPad package [Product Link] <http://www.futureelectronics.com/en/Technologies/Product.aspx?ProductID=IN150NGHARVATEKCORPORATION2049943&IM=0> 1206 - SMD1206 package [Product Link] <http://www.futureelectronics.com/en/technologies/semiconductors/optoelectronics/leds/Pages/8315665-LTST-C150KGKT.aspx?IM=0> 1206 Bottom Mount -SMD 1206 Bottom Mount [Product Link] <http://www.digikey.com/product-detail/en/lite-on-inc/LTST-C230KGKT/160-1456-1-ND/386854> SparkFun Products: Pro Mini 328 -5V <https://www.sparkfun.com/products/821> RedBoard <https://www.sparkfun.com/products/12757> MP3 Trigger <https://www.sparkfun.com/products/13720> Makey Makey <https://www.sparkfun.com/products/11076>; PROD_ID: DIO-00862
D2 D3 = nxp_60:BAV99S: High-speed switching diode High-speed switching diodes, encapsulated in small Surface-Mounted Device (SMD) plastic packages. AAL Eindhoven MK
D4-D9 = SparkFun-LED:LED-RED: Red SMD LED Used in manufacturing of most products at SparkFun Packages: 0603 - SMD 0603 package [Product Link] <http://docs.avagotech.com/docs/AV02-0551EN> 0603 SMART - SMD 0603 SMART package ( more efficient and expensive)[Product Link] <http://www.osram-os.com/Graphics/XPic2/00077099_0.pdf> 1206 - SMD1206 package [Product Link] <https://www.sparkfun.com/datasheets/DevTools/LilyPad/Q150OVS4.pdff> SparkFun Products: Pro Mini 328 -5V <https://www.sparkfun.com/products/821> RedBoard <https://www.sparkfun.com/products/12757> IOIO-OTG <https://www.sparkfun.com/products/13613>; PROD_ID: DIO-00819
IC1 = texas-ads1293:ADS1293: The ADS1293 incorporates all features commonly required in portable, low-power medical, sports, and fitness electrocardiogram (ECG) applications. With high levels of integration and exceptional performance, the ADS1293 enables the creation of scalable medical instrumentation systems at significantly reduced size, power, and overall cost. The library has been designed by Richard Magdycz <https://www.facebook.com/groups/eaglecadsoftUK>
IC2 = LP3878MR-ADJ_NOPB:LP3878MR-ADJ_NOPB: Micropower 800mA Low Noise 'Ceramic Stable' Adjustable Voltage Regulator for 1V to 5V App. Source: Datasheet <http://www.ti.com/lit/ds/symlink/lp3878-adj.pdf>; ARROW_PART_NUMBER: LP3878MR-ADJ/NOPB; ARROW_PRICE/STOCK: https://www.arrow.com/en/products/lp3878mr-adjnopb/texas-instruments; DESCRIPTION: Micropower 800mA Low Noise 'Ceramic Stable' Adjustable Voltage Regulator for 1V to 5V App.; HEIGHT: 1.68mm; MANUFACTURER_NAME: Texas Instruments; MANUFACTURER_PART_NUMBER: LP3878MR-ADJ/NOPB; RS_PART_NUMBER: 1218984; RS_PRICE/STOCK: http://uk.rs-online.com/web/p/products/1218984
J1 = SparkFun-Connectors:POWER_JACK: Power Jack Connector This is the standard 5.5mm barrel jack for power. The PTH is the most common, proven, reliable, footprint. The Slot footprint only works if the mill layer is transmitted to the PCB fab house so be warned. Here are the connectors we sell at SparkFun: DC Barrel Power Jack/Connector <https://www.sparkfun.com/products/119> (PRT-00119) DC Barrel Power Jack/Connector (SMD) <https://www.sparkfun.com/products/12748> (PRT-12748) DC Barrel Jack Adapter - Breadboard Compatible <https://www.sparkfun.com/products/10811> (PRT-10811) It is used on this SparkFun product (and many, many others): SparkFun RedBoard - Programmed with Arduino <https://www.sparkfun.com/products/12757> (DEV-12757) Also, if you need a mating power supply or connector, please check these out: Wall Adapter Power Supply - 9VDC 650mA <https://www.sparkfun.com/products/298> (TOL-00298) DC Barrel Jack Adapter - Male <https://www.sparkfun.com/products/10287> (PRT-10287); PROD_ID: CONN-08197
J2 = SparkFun-Connectors:USB_B: USB Type B Connector SparkFun Products: SparkFun Stepoko <https://www.sparkfun.com/products/13899> PTH; PROD_ID: CONN-08278; SF_ID: PRT-00139
J3 = SparkFun-Connectors:DB9: DB9 Connector Standard DB9 (D-Sub 9) serial connector. Can be used for CAN bus as well as RS485 and RS232. Footprint production proven. Here is the female version connector we sell at SparkFun: 9 Pin Female Serial Connector - PCB Mount <https://www.sparkfun.com/products/429> (PRT-00429) This connector has been used on the following SparkFun products: SparkFun RS232 Shifter - SMD <https://www.sparkfun.com/products/449> (PRT-00449) SparkFun RS232 Shifter SMD (No DB9) <https://www.sparkfun.com/products/8780> (PRT-08780); PROD_ID: CONN-08194
J5 TEST-CONN = SparkFun-Connectors:CONN_05: Multi connection point. Often used as Generic Header-pin footprint for 0.1 inch spaced/style header connections On any of the 0.1 inch spaced packages, you can populate with these: Break Away Headers - Straight <https://www.sparkfun.com/products/116> (PRT-00116) Break Away Male Headers - Right Angle <https://www.sparkfun.com/products/553> (PRT-00553) Female Headers <https://www.sparkfun.com/products/115> (PRT-00115) Break Away Headers - Machine Pin <https://www.sparkfun.com/products/117> (PRT-00117) Break Away Female Headers - Swiss Machine Pin <https://www.sparkfun.com/products/743> (PRT-00743) For SCREWTERMINALS and SPRING TERMINALS visit here: Screw Terimnals on SparkFun.com <https://www.sparkfun.com/search/results?term=Screw+Terminals> (5mm/3.5mm/2.54mm spacing) This device is also useful as a general connection point to wire up your design to another part of your project. Our various solder wires solder well into these plated through hole pads. Hook-Up Wire - Assortment (Stranded, 22 AWG) <https://www.sparkfun.com/products/11375> (PRT-11375) Hook-Up Wire - Assortment (Solid Core, 22 AWG) <https://www.sparkfun.com/products/11367> (PRT-11367) View the entire wire category on our website here <https://www.sparkfun.com/categories/141> Special notes: Molex polarized connector foot print use with SKU : PRT-08231 with associated crimp pins and housings. 1MM SMD Version SKU: PRT-10208
J6 = SparkFun-Connectors:CONN_06X2: Multi connection point. Often used as Generic Header-pin footprint for 0.1 inch spaced/style header connections On any of the 0.1 inch spaced packages, you can populate with these: Break Away Headers - Straight <https://www.sparkfun.com/products/116> (PRT-00116) Break Away Male Headers - Right Angle <https://www.sparkfun.com/products/553> (PRT-00553) Female Headers <https://www.sparkfun.com/products/115> (PRT-00115) Break Away Headers - Machine Pin <https://www.sparkfun.com/products/117> (PRT-00117) Break Away Female Headers - Swiss Machine Pin <https://www.sparkfun.com/products/743> (PRT-00743); PROD_ID: CONN-12423
J7 = SparkFun-Connectors:CONN_06: Multi connection point. Often used as Generic Header-pin footprint for 0.1 inch spaced/style header connections On any of the 0.1 inch spaced packages, you can populate with these: Break Away Headers - Straight <https://www.sparkfun.com/products/116> (PRT-00116) Break Away Male Headers - Right Angle <https://www.sparkfun.com/products/553> (PRT-00553) Female Headers <https://www.sparkfun.com/products/115> (PRT-00115) Break Away Headers - Machine Pin <https://www.sparkfun.com/products/117> (PRT-00117) Break Away Female Headers - Swiss Machine Pin <https://www.sparkfun.com/products/743> (PRT-00743) Arduino Stackable Header - 6 Pin <https://www.sparkfun.com/products/9280> (PRT-09280) For SCREWTERMINALS and SPRING TERMINALS visit here: Screw Terimnals on SparkFun.com <https://www.sparkfun.com/search/results?term=Screw+Terminals> (5mm/3.5mm/2.54mm spacing) This device is also useful as a general connection point to wire up your design to another part of your project. Our various solder wires solder well into these plated through hole pads. Hook-Up Wire - Assortment (Stranded, 22 AWG) <https://www.sparkfun.com/products/11375> (PRT-11375) Hook-Up Wire - Assortment (Solid Core, 22 AWG) <https://www.sparkfun.com/products/11367> (PRT-11367) View the entire wire category on our website here <https://www.sparkfun.com/categories/141>; PROD_ID: CONN-08437
L1-L4 = SparkFun-Coils:INDUCTOR: Inductors Resist changes in electrical current. Basically a coil of wire. SparkFun Products: SparkFun Load Cell Amplifier - HX711 <https://www.sparkfun.com/products/13879> IOIO-OTG - V2.2 <https://www.sparkfun.com/products/13613>; PROD_ID: NDUC-13076
POWER-CONN = SparkFun-Connectors:CONN_03: Multi connection point. Often used as Generic Header-pin footprint for 0.1 inch spaced/style header connections On any of the 0.1 inch spaced packages, you can populate with these: Break Away Headers - Straight <https://www.sparkfun.com/products/116> (PRT-00116) Break Away Male Headers - Right Angle <https://www.sparkfun.com/products/553> (PRT-00553) Female Headers <https://www.sparkfun.com/products/115> (PRT-00115) Break Away Headers - Machine Pin <https://www.sparkfun.com/products/117> (PRT-00117) Break Away Female Headers - Swiss Machine Pin <https://www.sparkfun.com/products/743> (PRT-00743) Stackable Header - 3 Pin (Female, 0.1") <https://www.sparkfun.com/products/13875> (PRT-13875) For SCREWTERMINALS and SPRING TERMINALS visit here: Screw Terimnals on SparkFun.com <https://www.sparkfun.com/search/results?term=Screw+Terminals> (5mm/3.5mm/2.54mm spacing) This device is also useful as a general connection point to wire up your design to another part of your project. Our various solder wires solder well into these plated through hole pads. Hook-Up Wire - Assortment (Stranded, 22 AWG) <https://www.sparkfun.com/products/11375> (PRT-11375) Hook-Up Wire - Assortment (Solid Core, 22 AWG) <https://www.sparkfun.com/products/11367> (PRT-11367) View the entire wire category on our website here <https://www.sparkfun.com/categories/141> Special notes: Molex polarized connector foot print use with SKU : PRT-08232 with associated crimp pins and housings.; PROD_ID: XXX-00000
POWER-JUMPER = SparkFun-Connectors:CONN_03: Multi connection point. Often used as Generic Header-pin footprint for 0.1 inch spaced/style header connections On any of the 0.1 inch spaced packages, you can populate with these: Break Away Headers - Straight <https://www.sparkfun.com/products/116> (PRT-00116) Break Away Male Headers - Right Angle <https://www.sparkfun.com/products/553> (PRT-00553) Female Headers <https://www.sparkfun.com/products/115> (PRT-00115) Break Away Headers - Machine Pin <https://www.sparkfun.com/products/117> (PRT-00117) Break Away Female Headers - Swiss Machine Pin <https://www.sparkfun.com/products/743> (PRT-00743) Stackable Header - 3 Pin (Female, 0.1") <https://www.sparkfun.com/products/13875> (PRT-13875) For SCREWTERMINALS and SPRING TERMINALS visit here: Screw Terimnals on SparkFun.com <https://www.sparkfun.com/search/results?term=Screw+Terminals> (5mm/3.5mm/2.54mm spacing) This device is also useful as a general connection point to wire up your design to another part of your project. Our various solder wires solder well into these plated through hole pads. Hook-Up Wire - Assortment (Stranded, 22 AWG) <https://www.sparkfun.com/products/11375> (PRT-11375) Hook-Up Wire - Assortment (Solid Core, 22 AWG) <https://www.sparkfun.com/products/11367> (PRT-11367) View the entire wire category on our website here <https://www.sparkfun.com/categories/141> Special notes: Molex polarized connector foot print use with SKU : PRT-08232 with associated crimp pins and housings.; PROD_ID: XXX-00000; VALUE: 455-1750-1-ND
R1 R10-R16 R20 R21 R24-R28 R30-R35 = SparkFun-Resistors:0OHM: 0Ω resistor A resistor is a passive two-terminal electrical component that implements electrical resistance as a circuit element. Resistors act to reduce current flow, and, at the same time, act to lower voltage levels within circuits. - Wikipedia; PROD_ID: RES-08609
R2 R5-R7 = SparkFun-Resistors:1MOHM: 1MΩ resistor A resistor is a passive two-terminal electrical component that implements electrical resistance as a circuit element. Resistors act to reduce current flow, and, at the same time, act to lower voltage levels within circuits. - Wikipedia; PROD_ID: RES-07868
R3 R4 = SparkFun-Resistors:22OHM: 22Ω resistor A resistor is a passive two-terminal electrical component that implements electrical resistance as a circuit element. Resistors act to reduce current flow, and, at the same time, act to lower voltage levels within circuits. - Wikipedia; PROD_ID: RES-08698; VALUE: 22
R8 R37 R46 = SparkFun-Resistors:10KOHM: 10kΩ resistor A resistor is a passive two-terminal electrical component that implements electrical resistance as a circuit element. Resistors act to reduce current flow, and, at the same time, act to lower voltage levels within circuits. - Wikipedia; PROD_ID: RES-00824
R9 = SparkFun-Resistors:10MOHM: RES-09327; PROD_ID: RES-08283
R17 = SparkFun-Resistors:2.55KOHM: 2.55kΩ resistor A resistor is a passive two-terminal electrical component that implements electrical resistance as a circuit element. Resistors act to reduce current flow, and, at the same time, act to lower voltage levels within circuits. - Wikipedia; PROD_ID: RES-11227
R18 R29 R50-R54 = SparkFun-Resistors:1KOHM: 1kΩ resistor A resistor is a passive two-terminal electrical component that implements electrical resistance as a circuit element. Resistors act to reduce current flow, and, at the same time, act to lower voltage levels within circuits. - Wikipedia; PROD_ID: RES-07856
R19 R44 = SparkFun-Resistors:4.7KOHM: 4.7kΩ resistor A resistor is a passive two-terminal electrical component that implements electrical resistance as a circuit element. Resistors act to reduce current flow, and, at the same time, act to lower voltage levels within circuits. - Wikipedia; PROD_ID: RES-07857
R22 = SparkFun-Resistors:75KOHM: 75Ω resistor A resistor is a passive two-terminal electrical component that implements electrical resistance as a circuit element. Resistors act to reduce current flow, and, at the same time, act to lower voltage levels within circuits. - Wikipedia; PROD_ID: RES-09737; VALUE: 75
R23 = SparkFun-Resistors:47KOHM: 47kΩ resistor A resistor is a passive two-terminal electrical component that implements electrical resistance as a circuit element. Resistors act to reduce current flow, and, at the same time, act to lower voltage levels within circuits. - Wikipedia; PROD_ID: RES-07871
R36 R47-R49 = SparkFun-Resistors:10OHM: 10Ω resistor A resistor is a passive two-terminal electrical component that implements electrical resistance as a circuit element. Resistors act to reduce current flow, and, at the same time, act to lower voltage levels within circuits. - Wikipedia; PROD_ID: RES-12581
R38-R43 = SparkFun-Resistors:330OHM: 330Ω resistor A resistor is a passive two-terminal electrical component that implements electrical resistance as a circuit element. Resistors act to reduce current flow, and, at the same time, act to lower voltage levels within circuits. - Wikipedia; PROD_ID: RES-00818; VALUE: 330
R45 = SparkFun-Resistors:1OHM: 1Ω resistor A resistor is a passive two-terminal electrical component that implements electrical resistance as a circuit element. Resistors act to reduce current flow, and, at the same time, act to lower voltage levels within circuits. - Wikipedia; PROD_ID: RES-08269
S1-S3 = SparkFun-Switches:MOMENTARY-SWITCH-SPST: Momentary Switch (Pushbutton) - SPST Normally-open (NO) SPST momentary switches (buttons, pushbuttons). Variants PTH-12MM - 12mm square, through-hole Momentary Pushbutton Switch - 12mm Square <https://www.sparkfun.com/products/9190> (COM-09190) PTH-6.0MM, PTH-6.0MM-KIT - 6.0mm square, through-hole Mini Pushbutton Switch <https://www.sparkfun.com/products/97> (COM-00097) KIT package intended for soldering kit's - only one side of pads' copper is exposed. PTH-RIGHT-ANGLE-KIT - Right-angle, through-hole Right Angle Tactile Button <https://www.sparkfun.com/products/10791> - Used on SparkFun BigTime Watch Kit <https://www.sparkfun.com/products/11734> SMD-12MM - 12mm square, surface-mount Tactile Button - SMD (12mm) <https://www.sparkfun.com/products/12993> (COM-12993) Used on SparkFun PicoBoard <https://www.sparkfun.com/products/11888> SMD-4.5MM - 4.5mm Square Trackball Switch Used on SparkFun Blackberry Trackballer Breakout <https://www.sparkfun.com/products/13169> SMD-4.6MMX2.8MM - 4.60mm x 2.80mm, surface mount Used on SparkFun SAMD21 Mini Breakout <https://www.sparkfun.com/products/13664> SMD-5.2MM, SMD-5.2-REDUNDANT - 5.2mm square, surface-mount Mini Pushbutton Switch - SMD <https://www.sparkfun.com/products/8720> (COM-08720) Used on Arduino Pro Mini <https://www.sparkfun.com/products/11114> REDUNDANT package connects both switch circuits together SMD-6.0X3.5MM - 6.0 x 3.5mm, surface mount Momentary Reset Switch SMD <https://www.sparkfun.com/products/8229> (COM-08229) SMD-6.2MM-TALL - 6.2mm square, surface mount Tactile Button - SMD (6mm) <https://www.sparkfun.com/products/12992> Used on SparkFun Digital Sandbox <https://www.sparkfun.com/products/12651> SMD-RIGHT-ANGLE - Right-angle, surface mount Used on SparkFun Block for Intel® Edison - Arduino <https://www.sparkfun.com/products/13036>; PROD_ID: SWCH-08441; SF_SKU: COM-00097
SIGNAL-CONN = SparkFun-Connectors:CONN_06: Multi connection point. Often used as Generic Header-pin footprint for 0.1 inch spaced/style header connections On any of the 0.1 inch spaced packages, you can populate with these: Break Away Headers - Straight <https://www.sparkfun.com/products/116> (PRT-00116) Break Away Male Headers - Right Angle <https://www.sparkfun.com/products/553> (PRT-00553) Female Headers <https://www.sparkfun.com/products/115> (PRT-00115) Break Away Headers - Machine Pin <https://www.sparkfun.com/products/117> (PRT-00117) Break Away Female Headers - Swiss Machine Pin <https://www.sparkfun.com/products/743> (PRT-00743) Arduino Stackable Header - 6 Pin <https://www.sparkfun.com/products/9280> (PRT-09280) For SCREWTERMINALS and SPRING TERMINALS visit here: Screw Terimnals on SparkFun.com <https://www.sparkfun.com/search/results?term=Screw+Terminals> (5mm/3.5mm/2.54mm spacing) This device is also useful as a general connection point to wire up your design to another part of your project. Our various solder wires solder well into these plated through hole pads. Hook-Up Wire - Assortment (Stranded, 22 AWG) <https://www.sparkfun.com/products/11375> (PRT-11375) Hook-Up Wire - Assortment (Solid Core, 22 AWG) <https://www.sparkfun.com/products/11367> (PRT-11367) View the entire wire category on our website here <https://www.sparkfun.com/categories/141>
U1 = SparkFun-IC-Power:V_REG_LM1117: Voltage Regulator LM1117 Standard adjustable voltage regulator but in SMD form. Spark Fun Electronics SKU : COM-00595; PROD_ID: VREG-08170
U2 = Texas Instruments_By_element14_Batch_1:TPS7A4901DGNR: ?36V, ?200mA, Ultralow-Noise, Negative LINEAR REGULATOR; MPN: TPS7A4901DGNR; OC_FARNELL: -; OC_NEWARK: 01T0879; PACKAGE: MSOP-8; SUPPLIER: Texas Instruments
U3 = AFE4400:AFE4400_RHA_40; MANUFACTURER_PART_NUMBER: afe4400_rha_40; VENDOR: Texas Instruments
U4 = Texas Instruments_By_element14_Batch_1:MSP430F149IPAG: Mixed Signal Microcontroller; MPN: MSP430F149IPAG; OC_FARNELL: 1470495; OC_NEWARK: 75C4041; PACKAGE: TQFP-64; SUPPLIER: Texas Instruments
U$5 = ch340g:CH340G
U$6 = xjtulogo:XJTULOGO: This is JIngjie's parts, XJTU's logo
Y1 = SparkFun-Clocks:CRYSTAL: Crystals (Generic) These are passive quartz crystals, which can be used as a clock source for a microcontroller. Crystal's are two-terminal devices. They require external "load" capacitors to generate an oscillating signal.
Y2 Y5 = SparkFun-Clocks:CRYSTAL-8MHZ: 8MHz Crystal Datasheet Example <http://www.futureelectronics.com/en/technologies/electromechanical/timing-devices/crystals/Pages/6008189-ABM3B-8.000MHZ-B2-T.aspx?IM=0> Frequency: 8MHz Frequency Tolerance: ±20ppm Load Capacitance: 18pF SparkFun Products: Pro Micro -3.3V/8MHz <https://www.sparkfun.com/products/12587> WAV Trigger <https://www.sparkfun.com/products/13660>; PROD_ID: XTAL-09431
Y3 = SparkFun-Clocks:CRYSTAL-12MHZ: 12.0MHz Crystal Frequency: 12.0MHz Frequency Tolerance: ±20ppm Load Capacitance: 18pF SparkFun Products: SparkFun Logomatic <https://www.sparkfun.com/products/12772> Pocket AVR Programmer <https://www.sparkfun.com/products/9825>; PROD_ID: XTAL-08297
Y4 = SparkFun-Clocks:CRYSTAL-32.768KHZ: 32.768kHz Crystal Frequency: 32.768kHz Frequency Stability: ±20ppm Load Capacitance: 12.5pF (PTH-2X6 & SMD-3.2X1.5), 6pF (SMD-2X6) SparkFun Products: SparkFun BigTime Watch Kit <https://www.sparkfun.com/products/11734> SparkFun nRF52832 Breakout <https://www.sparkfun.com/products/13990> SparkFun Real Time Clock Module <https://www.sparkfun.com/products/12708>; PROD_ID: XTAL-13062